# Altium schematic sheet CPU_EX.SchDoc
size B; Author: E. Sims; Organization: Let's Build Rockets Inc.
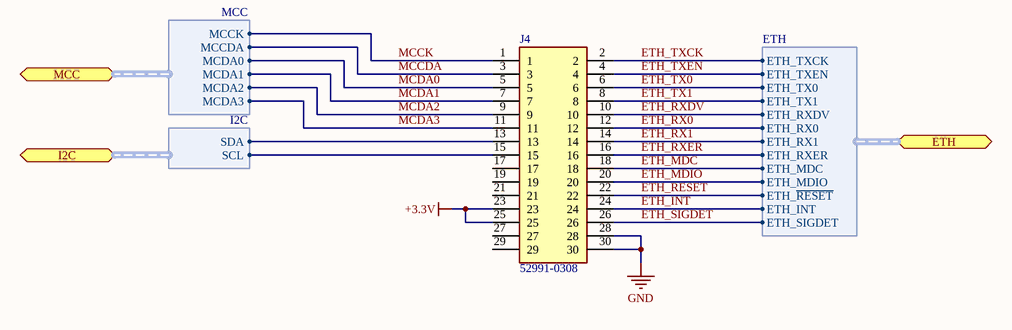
[diagram p0: CPU_EX.SchDoc]

## Parts
J4  52991-0308  [529910308]

## Ports
ETH (bidir, harness ETH), I2C (bidir, harness I2C), MCC (bidir, harness MCC)

## Harnesses
MCC: MCCK, MCCDA, MCDA0, MCDA1, MCDA2, MCDA3
ETH: ETH_TXCK, ETH_TXEN, ETH_TX0, ETH_TX1, ETH_RXDV, ETH_RX0, ETH_RX1, ETH_RXER, ETH_MDC, ETH_MDIO, ETH_~{RESET}, ETH_INT, ETH_SIGDET
I2C: SDA, SCL

## Nets
+3.3V: J4.23 J4.25
GND: J4.28 J4.30
ETH_INT: J4.24 ; port ETH.ETH_INT
ETH_MDC: J4.18 ; port ETH.ETH_MDC
ETH_MDIO: J4.20 ; port ETH.ETH_MDIO
ETH_~{RESET}: J4.22 ; port ETH.ETH_~{RESET}
ETH_RX0: J4.12 ; port ETH.ETH_RX0
ETH_RX1: J4.14 ; port ETH.ETH_RX1
ETH_RXDV: J4.10 ; port ETH.ETH_RXDV
ETH_RXER: J4.16 ; port ETH.ETH_RXER
ETH_SIGDET: J4.26 ; port ETH.ETH_SIGDET
ETH_TX0: J4.6 ; port ETH.ETH_TX0
ETH_TX1: J4.8 ; port ETH.ETH_TX1
ETH_TXCK: J4.2 ; port ETH.ETH_TXCK
ETH_TXEN: J4.4 ; port ETH.ETH_TXEN
MCCDA: J4.3 ; port MCC.MCCDA
MCCK: J4.1 ; port MCC.MCCK
MCDA0: J4.5 ; port MCC.MCDA0
MCDA1: J4.7 ; port MCC.MCDA1
MCDA2: J4.9 ; port MCC.MCDA2
MCDA3: J4.11 ; port MCC.MCDA3
NetJ4_13: J4.13 ; port I2C.SDA
NetJ4_15: J4.15 ; port I2C.SCL

Not connected (* = marked no-connect by the designer): J4 17 19 21 27 29

## Notes on the sheet
- Let's Build Rocket's Inc. Modular Paylaod System Based on TMP-010 Rev
  For more information visit https://github.com/LetsBuildRockets/Modular-Payload-System
  This work is licensed under CC BY-NC 4.0. To view a copy of this license, visit https://creativecommons.org/licenses/by-nc/4.0
- Title
- Size:
- Date:
- Assembly Variant:
- B
- Number:
- Time:
- Revision:
- Sheet
- of
- Author:
- File:

## Library data of the parts
J4 = 52991-0308: Connector; Manufacturer_Name: Molex; Unit Price (USD): 1.43; Datasheet Link: https://www.molex.com/pdm_docs/sd/529910308_sd.pdf; Height: 2.47mm; Manufacturer_Part_Number: 52991-0308; System: Connector